# EAGLE board MOTOR_DRIVER_dupl (EAGLE 8.0.1)
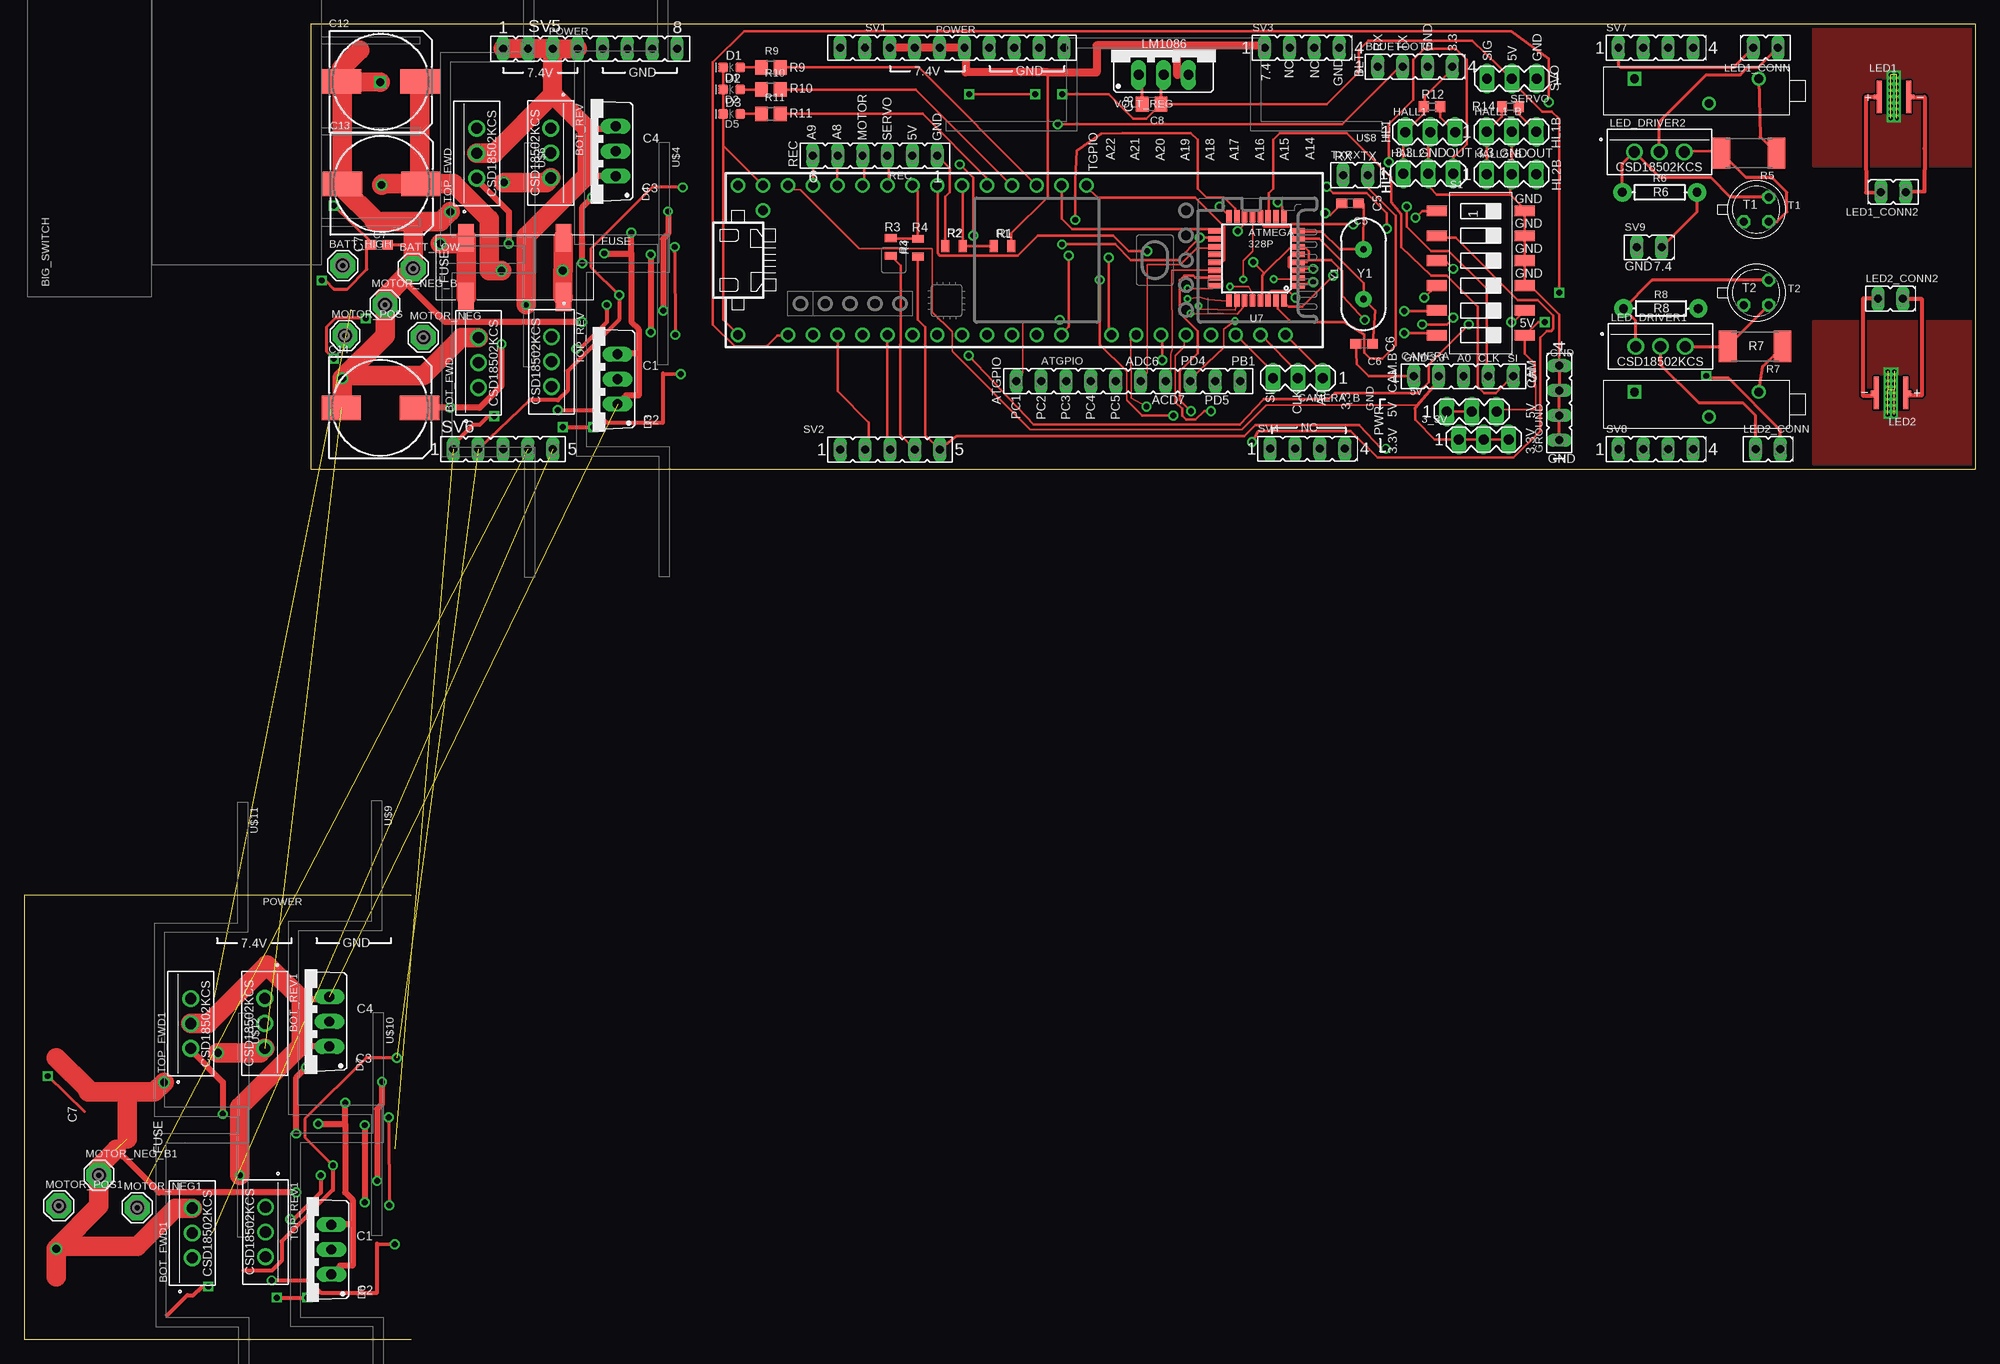
[diagram p5: board, top side]
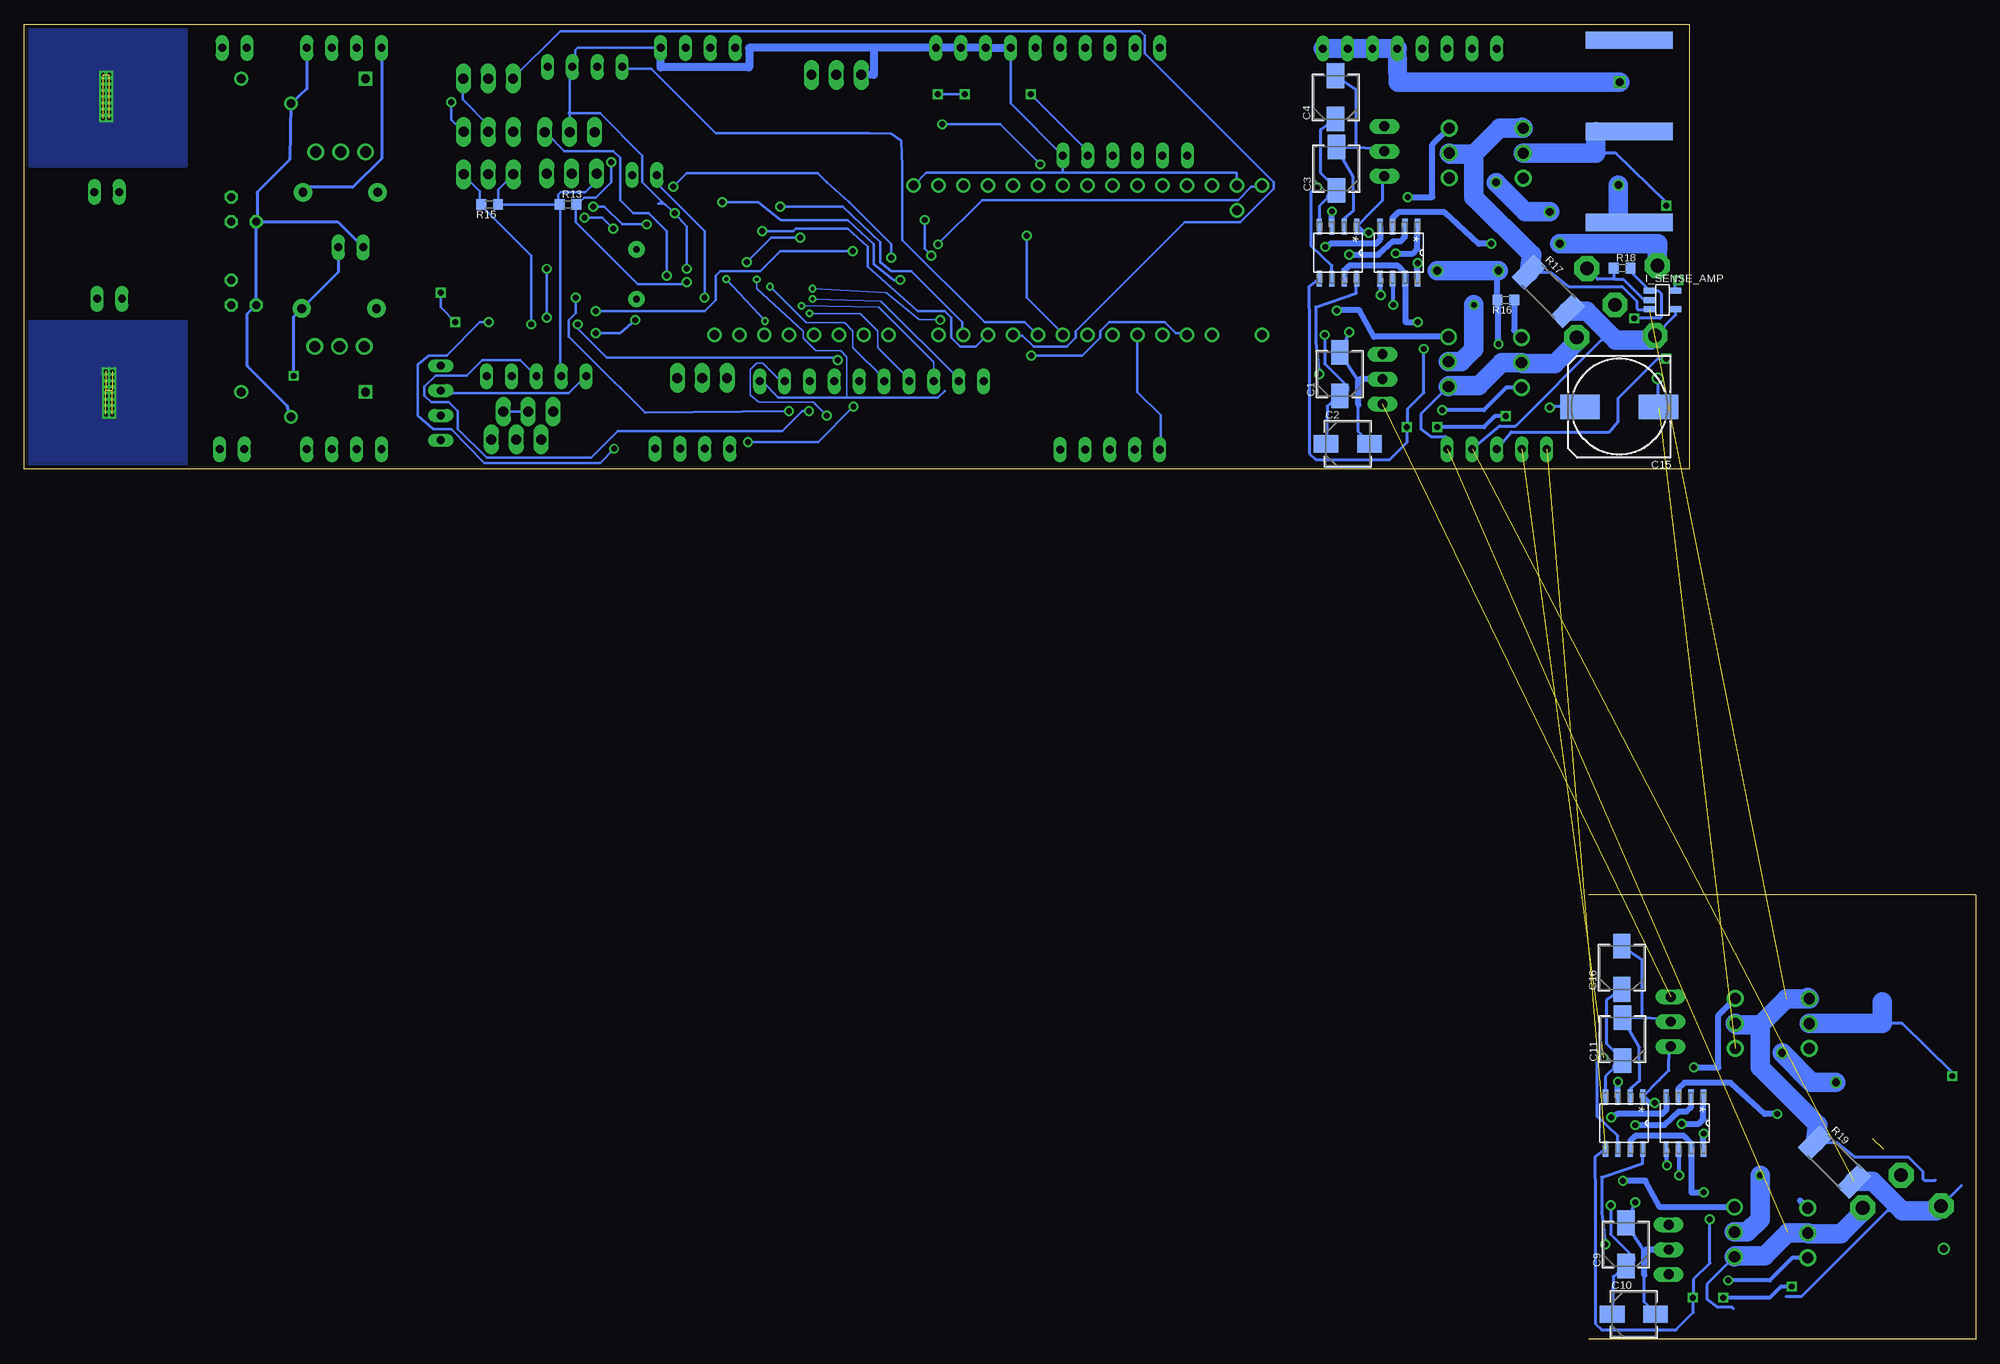
[diagram p6: board, bottom side, seen from below]

Size 199.21 x 134.29 mm. Coordinates in mm from the lower left corner, seen from the top.
Outline: 0,45.39 0,0
Outline: 0,45.39 39.5,45.39 39.5,45.39
Outline: 0,0 39.5,0
Outline: 29.21,88.9 199.21,88.9 199.21,134.29 29.21,134.29 29.21,88.9
Copper layers (1*16): Top 0.035559375mm / dielectric 1.501140625mm / Bottom 0.035559375mm
Design rules "typical_4pcb *": minimum track width 6mil, minimum drill 15mil, track to track 8mil, track to pad 8mil, pad to pad 8mil, via to via 8mil, smd to smd 6mil, copper to edge 15mil, drill to drill 8mil, minimum pad ring 10mil, minimum via ring 8mil, stop-mask expansion 4mil, vias tented up to drill 0mil, thermal gap 10mil
Net classes: 0 default: width 0.152 mm, drill 0.381 mm, clearance 0.152 mm

## Footprints (pad centres in the part's own frame; a part is rotated, then mirrored left to right if it is on the bottom)
MA03-1 = drill 1.016 long: 1 -2.54,0; 2 0,0; 3 2.54,0
FE10 = drill 0.813 long: 1 -11.43,0; 2 -8.89,0; 3 -6.35,0; 4 -3.81,0; 5 -1.27,0; 6 1.27,0; 7 3.81,0; 8 6.35,0; 9 8.89,0; 10 11.43,0
SE14 = drill 1.397 pad 2.54 octagon: MP 0,0
BIGSWITCH = smd 1.778 x 8.89 bottom: GND 4.65,0; NC 13.97,0; VCC -4.65,0
FE04-1 = drill 0.813 long: 1 -5.08,0; 2 -2.54,0; 3 0,0; 4 2.54,0
KCS3 = drill 1.143 pad 1.651: 1 -5.08,0; 2 -2.54,0; 3 0,0
CAP_EEE_B = smd 2.515 x 1.778: 1 -2.21,0; 2 2.21,0
C0603 = smd 1.1 x 1: 1 -0.85,0; 2 0.85,0
C0805 = smd 1.3 x 1.5: 1 -0.95,0; 2 0.95,0
153CLV-1010 = smd 4 x 2.5: + 4,0; - -4,0
FE05-1 = drill 0.813 long: 1 -5.08,0; 2 -2.54,0; 3 0,0; 4 2.54,0; 5 5.08,0
LED-0603 = smd 1 x 1: A -0.877,0; C 0.877,0
TO220ABS = drill 1.016 long: A1 -2.54,-2.54; A2 2.54,-2.54; C 0,-2.54
FUSEHOLDER3588 = smd 1.57 x 2.82: A -4.96,3.03; B 4.96,3.03; C -4.96,-3.03; D 4.96,-3.03
SOIC-8_M = smd 1.6 x 0.533: 1 -2.654,1.905; 2 -2.654,0.635; 3 -2.654,-0.635; 4 -2.654,-1.905; 5 2.654,-1.905; 6 2.654,-0.635; 7 2.654,0.635; 8 2.654,1.905
SOT23-5 = smd 0.6 x 1.2: 1 -0.95,-1.306; 2 0,-1.306; 3 0.95,-1.306; 4 0.95,1.306; 5 -0.95,1.306
XP = smd 0.5 x 3.3: NEGATIVE 1.5,0; POSITIVE -1.5,0 | smd 0.4 x 0.5: NEGATIVE1 1.85,0; POSITIVE1 -1.85,0 | smd 1.3 x 3.3: THERMAL 0,0
FE02-1 = drill 0.813 long: 1 -5.08,0; 2 -2.54,0
0805 = smd 0.8 x 1.2: 1 -0.9,0; 2 0.9,0
R2512 = smd 1.8 x 3.2: 1 -2.8,0; 2 2.8,0
AXIAL-0.3 = drill 0.9 pad 1.88: P$1 -3.81,0; P$2 3.81,0
R0805 = smd 1.3 x 1.5: 1 -0.95,0; 2 0.95,0
R0603 = smd 1 x 1.1: 1 -0.85,0; 2 0.85,0
FE06 = drill 0.813 long: 1 -6.35,0; 2 -3.81,0; 3 -1.27,0; 4 1.27,0; 5 3.81,0; 6 6.35,0
SMS-006 = smd 1.092 x 2.007: 1 -6.35,-4.496; 2 -3.81,-4.496; 3 -1.27,-4.496; 4 1.27,-4.496; 5 3.81,-4.496; 6 6.35,-4.496; 7 6.35,4.496; 8 3.81,4.496; 9 1.27,4.496; 10 -1.27,4.496; 11 -3.81,4.496; 12 -6.35,4.496
FE08 = drill 0.813 long: 1 -8.89,0; 2 -6.35,0; 3 -3.81,0; 4 -1.27,0; 5 1.27,0; 6 3.81,0; 7 6.35,0; 8 8.89,0
TO18 = drill 0.813 octagon: 1 -1.27,-1.27; 2 1.27,-1.27; 3 1.27,1.27
TQFP32-08 = smd 1.27 x 0.559: 1 -4.293,2.8; 2 -4.293,2; 3 -4.293,1.2; 4 -4.293,0.4; 5 -4.293,-0.4; 6 -4.293,-1.2; 7 -4.293,-2; 8 -4.293,-2.8; 17 4.293,-2.8; 18 4.293,-2; 19 4.293,-1.2; 20 4.293,-0.4; 21 4.293,0.4; 22 4.293,1.2; 23 4.293,2; 24 4.293,2.8 | smd 0.559 x 1.27: 9 -2.8,-4.293; 10 -2,-4.293; 11 -1.2,-4.293; 12 -0.4,-4.293; 13 0.4,-4.293; 14 1.2,-4.293; 15 2,-4.293; 16 2.8,-4.293; 25 2.8,4.293; 26 2,4.293; 27 1.2,4.293; 28 0.4,4.293; 29 -0.4,4.293; 30 -1.2,4.293; 31 -2,4.293; 32 -2.8,4.293
TEENSY_3.5/3.6_BASIC_FEWER_PIN = drill 0.965: 1/TX -22.86,-7.62; 2 -20.32,-7.62; 3/CANTX -17.78,-7.62; 3V3_LO -22.86,7.62; 4/CANRX -15.24,-7.62; 5 -12.7,-7.62; 6 -10.16,-7.62; 7 -7.62,-7.62; 8 -5.08,-7.62; 9/CS -2.54,-7.62; 10/CS 0,-7.62; 11/MOSI 2.54,-7.62; 12/MISO 5.08,-7.62; 13/SCK 5.08,7.62; 14/A0 2.54,7.62; 15/A1 0,7.62; 16/A2 -2.54,7.62; 17/A3 -5.08,7.62; 18/A4/SDA -7.62,7.62; 19/A5/SCL -10.16,7.62; 20/A6 -12.7,7.62; 21/A7 -15.24,7.62; 22/A8 -17.78,7.62; 23/A9 -20.32,7.62; 24 10.16,-7.62; 25 12.7,-7.62; 26 15.24,-7.62; 27 17.78,-7.62; 28 20.32,-7.62; 29 22.86,-7.62; 30 25.4,-7.62; 31/A12 27.94,-7.62; AGND -25.4,7.62; GND -27.94,-7.62; GND2 7.62,7.62; VIN -27.94,7.62; VUSB -25.4,5.08
POT = drill 0.9 square: P1 1.145,3.175 | drill 0.9: P2 3.685,10.795; P3 1.145,15.875
TO220S = drill 1.016 long: 1 -2.54,-2.54; 2 0,-2.54; 3 2.54,-2.54
HC49US = drill 0.7 pad 1.651: 1 -2.54,0; 2 2.54,0

## Placement (x,y rotation side)
3_3V  [MA03-1]  149,91.9 0 top
5V  [MA03-1]  147.78,94.75 0 top
ATGPIO  [FE10]  112.7,97.85 0 top
BATT_HIGH  SE14  [SE14]  32.48,109.66 0 top
BATT_LOW  SE14  [SE14]  39.68,109.36 0 top
BIG_SWITCH  [BIGSWITCH]  35.37,118.71 90 top
BLUETOOTH  [FE04-1]  143.26,129.97 0 top
BOT_FWD  CSD18502KCS_KCS_3  [KCS3]  46.35,102.29 90 top
BOT_FWD1  CSD18502KCS_KCS_3  [KCS3]  17.14,13.39 90 top
BOT_REV  CSD18502KCS_KCS_3  [KCS3]  53.75,118.62 270 top
BOT_REV1  CSD18502KCS_KCS_3  [KCS3]  24.54,29.72 270 top
C1  10uF  [CAP_EEE_B]  64.92,98.57 90 bottom
C2  10uF  [CAP_EEE_B]  64.1,91.45 0 bottom
C3  10uF  [CAP_EEE_B]  65.26,119.55 90 bottom
C4  10uF  [CAP_EEE_B]  65.33,126.84 90 bottom
C5  18 pF  [C0603]  135.36,116.01 180 top
C6  18 pF  [C0603]  136.79,101.67 180 top
C7  [C0603]  36.21,111.78 0 top
C8  10u  [C0805]  115.09,126.15 180 top
C9  10uF  [CAP_EEE_B]  35.71,9.67 90 bottom
C10  10uF  [CAP_EEE_B]  34.89,2.55 0 bottom
C11  10uF  [CAP_EEE_B]  36.05,30.65 90 bottom
C12  33u  [153CLV-1010]  36.38,128.45 0 top
C13  33u  [153CLV-1010]  36.47,118.01 0 top
C14  33u  [153CLV-1010]  36.33,95.15 0 top
C15  33u  [153CLV-1010]  36.38,95.25 180 bottom
C16  10uF  [CAP_EEE_B]  36.12,37.94 90 bottom
CAMERA  [FE05-1]  146.93,98.35 0 top
CAMERA_B  [MA03-1]  130.02,98.19 180 top
D1  [LED-0603]  72.21,129.9 180 top
D2  [LED-0603]  72.21,127.65 180 top
D3  BYV32  [TO220ABS]  58.01,98.06 90 top
D4  BYV32  [TO220ABS]  57.81,121.34 90 top
D5  [LED-0603]  72.21,125.15 180 top
D6  BYV32  [TO220ABS]  28.8,9.16 90 top
D7  BYV32  [TO220ABS]  28.6,32.44 90 top
FUSE  [FUSEHOLDER3588]  50.06,109.47 0 top
GATE1  MIC4604YM  [SOIC-8_M]  58.89,110.98 270 bottom
GATE2  MIC4604YM  [SOIC-8_M]  65.09,110.98 270 bottom
GATE3  MIC4604YM  [SOIC-8_M]  29.68,22.08 270 bottom
GATE4  MIC4604YM  [SOIC-8_M]  35.88,22.08 270 bottom
GROUND  [FE04-1]  156.71,96.9 90 top
HALL1  [MA03-1]  143.54,123.3 0 top
HALL1_B  [MA03-1]  151.84,123.32 0 top
HALL2  [MA03-1]  143.34,119.06 0 top
HALL2_B  [MA03-1]  151.84,118.98 0 top
I_SENSE_AMP  INA138  [SOT23-5]  31.96,106.15 270 bottom
LED1  CREE_XP  [XP]  190.88,126.88 0 top
LED1_CONN  [FE02-1]  173.96,131.9 180 top
LED1_CONN2  [FE02-1]  187.01,117.18 180 top
LED2  CREE_XP  [XP]  190.59,96.65 180 top
LED2_CONN  [FE02-1]  181.84,90.9 0 top
LED2_CONN2  [FE02-1]  194.34,106.28 0 top
LED_DRIVER1  CSD18502KCS_KCS_3  [KCS3]  169.59,101.4 0 top
LED_DRIVER2  CSD18502KCS_KCS_3  [KCS3]  169.46,121.28 0 top
MOTOR_NEG  SE14  [SE14]  40.72,102.33 0 top
MOTOR_NEG1  SE14  [SE14]  11.51,13.43 0 top
MOTOR_NEG_B  SE14  [SE14]  36.81,105.65 0 top
MOTOR_NEG_B1  SE14  [SE14]  7.6,16.75 0 top
MOTOR_POS  SE14  [SE14]  32.72,102.51 0 top
MOTOR_POS1  SE14  [SE14]  3.51,13.61 0 top
R1  2.8K  [0805]  99.87,111.64 0 top
R2  1.62K  [0805]  94.91,111.64 0 top
R3  2.32K  [0805]  88.45,111.55 270 top
R4  1.15K  [0805]  91.22,111.49 90 top
R5  1  [R2512]  176.09,121.15 180 top
R6  1k  [AXIAL-0.3]  166.96,117.15 0 top
R7  1  [R2512]  176.71,101.4 180 top
R8  1k  [AXIAL-0.3]  167.09,105.28 0 top
R9  59  [R0805]  76.21,129.9 0 top
R10  59  [R0805]  76.21,127.65 0 top
R11  59  [R0805]  76.21,125.15 0 top
R12  10k  [R0603]  143.71,125.9 0 top
R13  10k  [R0603]  143.71,115.9 0 bottom
R14  10k  [R0603]  151.71,125.9 0 top
R15  10k  [R0603]  151.71,115.9 180 bottom
R16  10k  [R0603]  47.96,106.15 180 bottom
R17  10m  [R2512]  43.61,107.01 315 bottom
R18  10k  [R0603]  36.09,109.4 0 bottom
R19  10m  [R2512]  14.4,18.11 315 bottom
REC  [FE06]  86.84,120.9 180 top
S1  SWS006  [SMS-006]  148.69,108.89 270 top
SERVO  [MA03-1]  151.87,128.75 180 top
SV1  [FE10]  94.71,131.9 0 top
SV2  [FE05-1]  88.38,90.87 0 top
SV3  [FE04-1]  131.71,131.9 0 top
SV4  [FE04-1]  132.27,90.95 0 top
SV5  [FE08]  57.76,131.83 0 top
SV6  [FE05-1]  48.87,90.91 0 top
SV7  [FE04-1]  167.84,131.9 0 top
SV8  [FE04-1]  167.84,90.9 0 top
SV9  [FE02-1]  169.71,111.53 0 top
T1  2N2222  [TO18]  176.84,115.4 0 top
T2  2N2222  [TO18]  176.84,106.9 0 top
TOP_FWD  CSD18502KCS_KCS_3  [KCS3]  46.18,123.68 90 top
TOP_FWD1  CSD18502KCS_KCS_3  [KCS3]  16.97,34.78 90 top
TOP_REV  CSD18502KCS_KCS_3  [KCS3]  53.82,97.31 270 top
TOP_REV1  CSD18502KCS_KCS_3  [KCS3]  24.61,8.41 270 top
TXRX  [FE02-1]  139.71,118.9 0 top
U7  ATMEGA328P_TQFP  [TQFP32-08]  125.79,110.38 180 top
U$1  TEENSY_3.5/3.6_FEWER  [TEENSY_3.5/3.6_BASIC_FEWER_PIN]  100.81,110.22 0 top
U$2  HEATSINK  [HEATSINK]  56.16,121.71 270 top
U$3  POT  [POT]  161.21,97.9 270 top
U$4  HEATSINK  [HEATSINK]  56.33,100.06 270 top
U$5  HEATSINK  [HEATSINK]  42.46,121.54 270 top
U$6  HEATSINK  [HEATSINK]  42.6,100.01 270 top
U$7  POT  [POT]  161.21,129.9 270 top
U$8  [HEATSINK]  116.34,132.9 180 top
U$9  HEATSINK  [HEATSINK]  26.95,32.81 270 top
U$10  HEATSINK  [HEATSINK]  27.12,11.16 270 top
U$11  HEATSINK  [HEATSINK]  13.25,32.64 270 top
U$12  HEATSINK  [HEATSINK]  13.39,11.11 270 top
VOLT_REG  LM1086TO220V  [TO220S]  116.31,131.69 0 top
Y1  16MHz  [HC49US]  136.71,108.78 90 top

## Tracks (layer width: path | path; a pad name or v marks a point on that pad's centre or on a via)
3_3V
  Top 0.152: U$1.3V3_LO 78.21,117.4 79.21,117.4 85.21,111.4 92.71,111.4 92.71,104.9 94.71,102.9 94.71,100.9 102.71,92.9 124.3,92.9 126.8,95.4 142.21,95.4 142.22,95.39
  Top 0.25: R14.1 150.86,124.89 HALL1_B.1 HALL2_B.1 | HALL2.1 140.8,123.1 HALL1.1 142.86,125.17 R12.1 142.96,126 142.96,126.9 145.8,129.74 BLUETOOTH.4
  Top 0.254: 3_3V.3 3_3V.2 3_3V.1 144.02,91.9 141.99,93.93 141.99,95.04 141.96,95.07
  Top 0.305: CAMERA.2 144.39,97.97 142.22,95.39 141.96,95.07
  Bottom 0.25: HALL2.1 140.8,118.31 141.96,117.15 144.46,117.15 144.71,116.9 144.71,116.05 R13.1 R15.1 150.86,117.42 HALL2_B.1
  Bottom 0.254: R13.1 144.53,115.69 144.53,98.43 CAMERA.2
5V  (via drill 0.6)
  Top 0.152: 5V.3 149.54,94.93 154.31,94.93 154.31,97.47 154.21,97.47
  Top 0.25: 154.21,97.32 154.21,97.47 154.21,99.65 153.19,100.67 S1.7 154.55,103.9 v155.21,103.9 | 5V.2 5V.1 | v96.46,127.15 v103.21,127.15 | v105.96,127.15 110.71,127.15 113.21,124.65 114.54,124.65 C8.1 132.96,126.15 136.21,129.4 136.21,131.65 137.21,132.65 147.84,132.65 SERVO.2 151.87,128.49 154.96,125.4 155.96,125.4 156.71,124.65 v156.71,106.9
  Top 0.305: C8.1 116.04,128.87 VOLT_REG.2
  Bottom 0.25: REC.2 90.65,121.34 v96.46,127.15 | 5V.3 5V.2 | v103.21,127.15 v105.96,127.15 | v156.71,106.9 156.71,105.4 v155.21,103.9
5V_TEENSY  (via drill 0.6)
  Top 0.254: 126.6,108.88 129.32,111.6 130,111.6 U7.6 130.23,111.6 130.68,111.6 131.14,111.15 131.14,110.24 | 126.6,108.88 126.37,108.65 126.37,106.15 U7.29 | 126.6,108.88 v125.46,110.01 | U7.18 121.38,112.51 v120.01,112.51 117.74,110.24 112.98,110.24 111.39,111.83 v105.94,111.83 | 131.14,110.24 130.91,110.01 130.23,110.01 U7.4 | v140.9,102.75 144.07,102.75 S1.6 | v136.83,104.11 134.54,106.61 134.54,109.1 133.41,110.24 131.14,110.24
  Bottom 0.254: v120.01,112.51 122.96,112.51 v125.46,110.01 | v140.9,102.75 138.4,102.75 v136.83,104.11 | v105.94,111.83 101.4,116.37 75.29,116.37 73.93,117.73 73.02,117.73 U$1.VIN
7_4V
  Top 0.25: R1.2 100.77,112.96 104.46,116.65 104.46,129.4
  Top 0.813: 117.71,132.15 109.46,132.15 109.46,129.4 104.46,129.4 96.09,129.4 96.09,131.8 SV1.6 SV1.5 SV1.4 SV1.3 | 117.71,132.15 126.63,132.15 SV3.1 | VOLT_REG.3 117.71,129.15 117.71,132.15
7_4V_TOP  (via drill 0.6)  (1 unrouted)
  Top 0.305: v30.34,108.15 30.71,108.15 31.59,107.28 32.96,107.28 34.96,109.28 34.96,111.38 C7.1 35.36,112.12 v31.59,115.78 | 6.15,23.23 v2.38,26.88
  Top 0.61: 61.96,110.9 v61.96,113.04 | 61.96,110.9 61.96,103.9 62.71,103.15 62.71,100.65 | 57.46,123.65 60.12,123.65 D4.A2 | D4.A1 57.56,118.8 57.46,118.9 | 62.71,100.65 60.6,100.65 D3.A2 | D3.A1 61.43,96.4 62.71,96.4 62.71,100.65 | v59.21,110.9 61.96,110.9 | 32.75,22 v32.75,24.14 | 32.75,22 32.75,15 33.5,14.25 33.5,11.75 | 28.25,34.75 30.91,34.75 D7.A2 | D7.A1 28.35,29.9 28.25,30 | 33.5,11.75 31.39,11.75 D6.A2 | D6.A1 32.22,7.5 33.5,7.5 33.5,11.75 | v30,22 32.75,22
  Top 1.93: 53.96,127.15 SV5.3 | SV5.3 SV5.4 | SV5.3 SV5.2 SV5.1
  Top 2: TOP_FWD.2 47.95,121.14 53.96,127.15 57.46,123.65 57.46,118.9 51.21,112.65 v51.21,105.65 | TOP_FWD1.2 18.74,32.24 24.75,38.25 28.25,34.75 28.25,30 22,23.75 v22,16.75
  Bottom 0.305: GATE2.1 61.49,115.38 60.51,116.35 60.5,118.65 | I_SENSE_AMP.5 30.65,107.83 v30.34,108.15 | v31.59,115.78 31.59,116.15 36.71,121.15 38.74,121.15 38.75,121.14 | GATE4.1 32.28,26.48 31.3,27.45 31.29,29.75 | v2.38,26.88 2.38,27.25 7.5,32.25 9.53,32.25 9.54,32.24
  Bottom 0.61: 60.5,118.65 D4.A1 | 56.96,113.66 GATE1.1 56.99,111.38 57.46,110.9 v59.21,110.9 | v61.96,113.04 62.59,113.04 GATE2.1 | 31.29,29.75 D7.A1 | 27.75,24.76 GATE3.1 27.78,22.48 28.25,22 v30,22 | v32.75,24.14 33.38,24.14 GATE4.1
  Bottom 1.27: BIG_SWITCH.GND 38.75,123.36 38.96,123.15 | 9.54,34.46 9.75,34.25
  Bottom 2: TOP_FWD.2 38.75,121.14 38.75,123.36 | TOP_REV.2 52.51,99.85 51.21,101.15 v51.21,105.65 | TOP_FWD1.2 9.54,32.24 9.54,34.46 | TOP_REV1.2 23.3,10.95 22,12.25 v22,16.75
7_4V_TOP2  (via drill 0.6)
  Top 0.305: SV7.1 162.76,130.11 162.96,129.9 174.5,129.9 LED1_CONN.2 | R6.P$2 170.77,115.12 SV9.2 | LED2_CONN.2 179.3,92.87 174.01,98.15 171.96,98.15 v171.71,98.4
  Bottom 0.305: SV7.1 162.76,120.61 165.71,117.65 170.27,117.65 R6.P$2 | SV9.2 167.17,109 R8.P$2 171.71,104.46 v171.71,98.4
ADC6
  Top 0.152: U7.19 121.29,111.44 119.7,111.44 118,109.74 114.62,109.74 114.62,98.74 113.98,98.11 ATGPIO.6
  Top 0.254: 121.38,111.6 U7.19
ADC7
  Top 0.152: U7.22 121.29,109.22 117.16,109.22 117.2,101.09 117.04,100.62 117.04,98.31 116.58,97.85 ATGPIO.7
  Top 0.254: 121.38,109.1 U7.22
BATT_VOLTAGE  (via drill 0.8)
  Top 0.813: 45.1,111.9 44.21,111.9
  Top 2: FUSE.A 45.1,111.9 FUSE.C | 44.21,111.9 v42.46,111.9
  Bottom 2: BATT_HIGH.MP 32.48,111.4 32.46,111.4 32.46,111.9 v42.46,111.9
BATT_VOLTAGE_SENSE
  Top 0.25: U$1.17/A3 95.81,117.76 R2.2 R1.1
BLT_RX
  Bottom 0.254: BLUETOOTH.1 138.17,129.76 135.22,129.76 128.64,123.18 112.98,123.18 110.71,123.15 109.71,122.4 109.57,119.77 109.57,112.28 101.17,103.88 97.09,103.88 95.95,102.75 U$1.8
BLT_TX  (via drill 0.6)
  Top 0.254: v105.48,124.09 134.54,124.09 140.22,129.76 140.67,129.76 BLUETOOTH.2 | v95.5,120 96.86,118.64 v96.86,112.74
  Bottom 0.254: v105.48,124.09 99.58,124.09 v95.5,120 | v96.86,112.74 96.86,106.38 93.23,102.75 U$1.7
CAMERA_A0  (via drill 0.6)
  Top 0.254: v119.11,94.8 117.97,95.94 117.97,98.89 119.79,100.7 119.79,102.97 117.97,104.79 117.97,108.2 118.42,108.65 119.33,108.65 119.56,108.42 121.38,108.42 U7.23
  Bottom 0.254: v119.11,94.8 119.79,94.8 121.83,92.76 138.63,92.76 141.35,90.04 152.02,90.04 154.97,92.99 154.97,94.8 155.88,95.71 157.69,95.71 158.38,96.39 158.38,97.3 157.24,98.43 154.06,98.43 152.47,100.02 148.62,100.02 147.03,98.43 CAMERA.3
CAMERA_A0_B
  Top 0.152: CAMERA_B.1 132.72,98.43 132.72,98.74 132.66,98.69
  Top 0.25: 132.76,98.59 132.66,98.69 U$1.31/A12
CAMERA_CL  (via drill 0.6)
  Top 0.254: v135.68,113.87 129.32,113.87 129.09,113.64 126.6,113.64 126.37,113.87 126.37,114.55 U7.12 | v141.12,115.69 141.12,113.64 143.62,111.15 145.44,111.15 149.3,107.29 149.3,98.43 CAMERA.4
  Bottom 0.254: v135.68,113.87 138.17,113.87 139.99,115.69 v141.12,115.69
CAMERA_CL_B
  Top 0.152: CAMERA_B.2 130.18,98.43 130.18,98.74 130.12,98.69
  Top 0.25: 130.22,98.59 130.12,98.69 U$1.30
CAMERA_SI
  Top 0.254: U7.11 127.05,114.78 127.05,117.05 127.5,117.5 127.5,122.5 128.19,123.18 135,123.18 139.53,118.64 139.53,116.12 140.56,114.92 140.56,111.54 143.62,108.65 145.21,108.65 148.39,105.47 148.39,97.3 149.07,96.62 150.2,96.62 151.79,98.21 CAMERA.5
CAMERA_SI_B
  Top 0.152: CAMERA_B.3 127.64,98.43 127.64,98.74 127.58,98.69
  Top 0.25: 127.68,98.59 127.58,98.69 U$1.29
EMF_SENSE_HIGH
  Top 0.25: R3.1 88.52,112.39 R4.2 91.22,117.27 U$1.19/A5/SCL
EMF_SENSE_LOW  (via drill 0.6)
  Top 0.254: v140.9,105.02 144.07,105.02 S1.5 | v114.65,111.15 112.75,111.15 111.16,112.74 103.44,112.74 101.4,110.69 93.45,110.69 93.23,110.92 93.23,117.73 U$1.18/A4/SDA
  Bottom 0.254: v140.9,105.02 129.77,105.02 128.64,106.15 128.64,108.65 128.19,109.1 124.1,109.1 122.06,111.15 v114.65,111.15
GND  (via drill 0.6)
  Top 0.25: D1.C D2.C D5.C 71.33,121.92 | 71.33,121.92 U$1.AGND | 71.33,121.92 71.33,104.14 U$1.GND | R2.1 94.01,116.7 94.46,117.15 94.46,119.62 REC.1 | 137.91,98.35 CAMERA.1 | C6.2 136.01,99.66 | 156.71,104.65 153.74,107.62 S1.9 S1.10 S1.11 S1.12 153.19,115.42 151.71,116.9 | 151.71,116.9 144.21,116.9 143.46,117.65 143.46,118.94 HALL2.2 143.34,123.1 HALL1.2 | 151.71,116.9 151.71,118.86 HALL2_B.2 HALL1_B.2
  Top 0.254: U7.5 130,110.69 129.32,110.69 129.09,110.47 129.09,109.56 129.32,109.33 130,109.33 U7.3 130.23,109.33 v131.59,109.33 | U7.21 121.6,110.01 122.28,110.01 122.51,110.24 122.51,113.64 119.56,116.59 109.57,116.59 108.44,117.73 U$1.GND2 | 136.01,99.66 136.01,99.6 137.26,98.35 137.9,98.35 137.91,98.35 | 156.71,104.65 GROUND.4 | C5.2 134.51,115.96 133.35,114.81 v132.8,115.02
  Top 0.305: GROUND.1 GROUND.2 GROUND.3 GROUND.4 | C8.2 114.14,128.78 VOLT_REG.1
  Bottom 0.25: U$1.AGND 75.41,119.1 75.46,119.15 93.21,119.15 | 93.21,119.15 93.21,120.88 REC.1 98.52,126.24 SV1.7 | 93.21,119.15 107.12,119.15 U$1.GND2 | HALL1_B.2 151.84,124.03 154.46,126.65 154.46,128.57 SERVO.1 | HALL1.2 143.54,125.22 143.54,129.69 BLUETOOTH.3 142.96,130.27 142.96,131.65 142.71,131.9 SV3.4
  Bottom 0.254: v131.59,109.33 131.59,113.64 v132.8,115.02 133.86,115.91 C5.2 134.09,116.14 136.13,118.18 136.13,120.91 140.44,125.22 143.54,125.22 143.62,125.22 | CAMERA.1 142.03,98.21 143.62,96.62 156.33,96.62 156.56,96.84 GROUND.3
  Bottom 0.81: SV1.7 SV1.8 SV1.9 SV1.10
  Bottom 0.813: SV1.10 112.46,131.9 | 112.46,131.9 125.21,131.9 125.21,129.9 134.25,129.9 SV3.4 | VOLT_REG.1 112.46,129.15 112.46,131.9
GND_TOP  (via drill 0.6, 0.8, 0.8 pad 0.61)  (2 unrouted)
  Top 0.305: C7.2 39.46,111.78 39.71,111.53 | 10.25,22.88 10.5,22.62
  Top 0.4: 38.59,108.27 39.34,107.52 38.68,107.52 MOTOR_NEG_B.MP | 9.38,19.37 10.13,18.62 9.47,18.62 MOTOR_NEG_B1.MP
  Top 0.61: 39.34,107.52 42.96,103.9 v56.96,103.9 | 10.13,18.62 13.75,15 v27.75,15
  Top 2: C12.- 32.47,128.36 C13.- 32.47,117.64 35.71,114.4 35.71,114.15 39.71,114.15 | C12.- 32.38,129.82 34.21,131.65 | 32.71,98.4 36.81,102.5 MOTOR_NEG_B.MP 36.81,106.49 38.59,108.27 BATT_LOW.MP 39.71,109.36 39.71,111.53 39.71,114.15 | C14.- 32.46,95.28 v32.46,98.15 32.71,98.4 | BOT_FWD.3 44.6,102.29 40.71,98.4 32.71,98.4 | 39.71,114.15 42.46,114.15 v43.46,115.15 | v48.96,118.15 53.28,118.15 BOT_REV.3 | C12.- v36.34,128.4 | 3.5,9.5 7.6,13.6 MOTOR_NEG_B1.MP 7.6,17.59 9.38,19.37 | 3.25,6.38 v3.25,9.25 3.5,9.5 | 3.26,28.74 6.5,25.5 6.5,25.25 10.5,25.25 | 10.5,25.25 10.5,22.62 10.5,20.46 | BOT_FWD1.3 15.39,13.39 11.5,9.5 3.5,9.5 | 10.5,25.25 13.25,25.25 v14.25,26.25 | v19.75,29.25 24.07,29.25 BOT_REV1.3
  Bottom 0.305: C15.- 32.38,98.07 v32.46,98.15 | I_SENSE_AMP.2 33.84,106.15 35.96,108.28 36.84,108.28 | 36.84,108.28 38.6,108.28 BATT_LOW.MP | R18.1 36.94,108.38 36.84,108.28 | 3.17,9.17 v3.25,9.25
  Bottom 0.61: 58.21,108.28 58.21,103.9 v56.96,103.9 | 58.21,108.28 GATE1.7 | GATE2.7 64.46,109.15 63.96,109.65 58.96,109.65 58.21,108.9 58.21,108.28 | R16.1 47.11,103.05 BOT_FWD.3 | 29,19.38 29,15 v27.75,15 | 29,19.38 GATE3.7 | GATE4.7 35.25,20.25 34.75,20.75 29.75,20.75 29,20 29,19.38 | 17.9,14.15 BOT_FWD1.3
  Bottom 1.93: 58.96,128.4 SV5.5 SV5.6 SV5.7 SV5.8
  Bottom 2: v43.46,115.15 45.96,115.15 v48.96,118.15 | v36.34,128.4 58.96,128.4 | v14.25,26.25 16.75,26.25 v19.75,29.25
GND_TOP2
  Bottom 0.305: U$3.P2 172.38,95.32 176.46,99.4 176.46,104.74 T2.1 T1.1 | SV7.4 170.38,127.72 U$7.P2 172.13,120.48 175.46,117.15 175.46,114.24 T1.1 | T1.1 167.24,114.13 SV9.1
HALL1  (via drill 0.6)
  Top 0.25: R12.2 144.56,124.82 HALL1.3
  Top 0.254: v133.63,108.65 130.45,105.47 129.09,105.47 128.64,105.93 U7.32
  Bottom 0.254: v133.63,108.65 133.63,113.19 135.45,115.01 137.04,115.01 138.4,116.37 138.4,120.68 139.08,121.36 144.07,121.36 145.89,123.18 HALL1.3
HALL1_B  (via drill 0.6)
  Top 0.25: R14.2 152.56,125.14 HALL1_B.3
  Top 0.254: v155.65,126.36 155.65,130.78 151.79,133.62 73.48,133.62 70.3,130.44 70.3,103.66 72.57,101.39 75.75,101.39 76.88,102.52 77.79,102.52 U$1.1/TX
  Bottom 0.254: v155.65,126.36 155.65,124.54 154.52,123.4 HALL1_B.3
HALL2  (via drill 0.6)
  Top 0.254: v131.59,107.97 131.14,107.97 130.91,107.74 130.23,107.74 U7.1 | v139.31,120.23 139.31,124.09 141.81,126.58 141.81,130.67 142.94,131.8 146.12,131.8 147.25,130.67 147.25,122.04 145.89,120.68 145.89,119.09 HALL2.3
  Bottom 0.254: v131.59,107.97 131.82,107.74 136.58,107.74 142.94,114.1 142.94,115.69 R13.2 142.71,115.91 142.03,116.59 140.9,116.59 139.31,118.18 v139.31,120.23
HALL2_B  (via drill 0.6)
  Top 0.254: v147.48,103.66 143.39,99.57 143.39,97.75 142.26,96.62 133.79,96.62 133.17,96 132.42,96.01 126.52,96.01 124.1,93.44 103.06,93.44 v96.43,100.48
  Bottom 0.254: HALL2_B.3 154.29,118.86 152.7,117.28 152.7,115.91 R15.2 152.47,115.69 147.48,110.69 v147.48,103.66 | v96.43,100.48 91.18,100.48 89.37,102.29 89.37,102.97 88.46,103.88 82.78,103.88 81.65,102.75 80.52,102.75 U$1.2
HI
  Top 0.25: U$1.3/CANTX 83.03,96.83 86.21,93.65 86.21,91.29 SV2.2
HI_TOP  (via drill 0.6, 0.6 pad 0.61)  (1 unrouted)
  Top 0.305: v67.21,117.65 64.09,117.65 57.84,111.4 57.84,109.53 v60.71,106.65 | 51.57,95.9 SV6.2 | v38,28.75 34.88,28.75 28.63,22.5 28.63,20.62 v31.5,17.75
  Top 0.4: v60.71,106.65 60.71,104.15 55.46,98.9 55.46,96.9 54.46,95.9 51.57,95.9 | v31.5,17.75 31.5,15.25 26.25,10 26.25,8 25.25,7 22.36,7
  Bottom 0.305: GATE2.6 65.73,109.67 67.84,111.65 67.84,117.15 v67.21,117.65 | GATE4.6 36.52,20.77 38.63,22.75 38.63,28.25 v38,28.75
  Bottom 0.4: GATE1.5 60.8,106.74 v60.71,106.65 | GATE3.5 31.59,17.84 v31.5,17.75
I_SENSE
  Top 0.254: SV2.3 88.12,91.15 U$1.5
I_SENSE_HI_TOP  (2 unrouted)
  Bottom 0.305: R17.1 43.43,108.99 41.59,107.53 36.09,107.53 34.59,106.03 34.59,105.28 34.46,105.15 33.32,105.15 I_SENSE_AMP.3 | R19.1 14.22,20.09 12.38,18.62 6.88,18.62 5.38,17.12 5.38,16.38 5.25,16.25 4.11,16.25
  Bottom 2: R17.1 45.33,110.77 51.21,116.65 51.21,121.03 | 51.21,121.03 53.61,121.03 BOT_REV.2 | 46.32,123.82 TOP_FWD.3 48.56,123.68 51.21,121.03 | R19.1 16.12,21.87 22,27.75 22,32.13 | 22,32.13 24.4,32.13 BOT_REV1.2 | 17.11,34.92 TOP_FWD1.3 19.35,34.78 22,32.13
I_SENSE_LOW_TOP  (2 unrouted)
  Bottom 0.305: I_SENSE_AMP.4 30.65,104.58 MOTOR_POS.MP | 36.71,102.03 38.21,102.03 46.96,93.28 48.59,93.28 SV6.4 | 1.45,15.68 MOTOR_POS1.MP | 7.5,13.12 9,13.12 17.75,4.38 19.38,4.38
  Bottom 2: R17.2 39.72,105.03 36.71,102.03 33.21,102.03 MOTOR_POS.MP 32.86,102.65 | R19.2 10.51,16.13 7.5,13.12 4,13.12 MOTOR_POS1.MP 3.65,13.75
I_SENSE_TOP  (via drill 0.6)
  Top 0.305: v34.84,104.28 31.71,104.28 30.84,103.4 30.84,100.9 v31.59,100.15
  Bottom 0.305: R18.2 35.24,109.07 I_SENSE_AMP.1 32.41,107.1 32.09,106.78 32.09,104.4 32.21,104.28 v34.84,104.28 | v31.59,100.15 32.46,100.15 36.46,96.15 36.46,93.78 37.41,92.68 47.41,92.68 SV6.3
LED1
  Top 0.25: R9.2 91.29,129.9 U$1.14/A0
LED1HI
  Top 0.152: LED1.POSITIVE1 189.23,127 LED1.POSITIVE
  Top 0.406: LED1.POSITIVE LED1.POSITIVE1 188.01,126.88 188.01,121.63 188.05,117.13 LED1_CONN2.2
LED1LO
  Top 0.152: LED1.NEGATIVE1 192.72,127 LED1.NEGATIVE1
  Top 0.406: LED1.NEGATIVE LED1.NEGATIVE1 194.01,126.88 194.01,121.63 193.99,117.23 LED1_CONN2.1
LED2
  Top 0.25: R10.2 91,127.65 U$1.15/A1
LED2HI
  Top 0.152: LED2.POSITIVE 192.09,96.84 192.41,96.84 LED2.POSITIVE1
  Top 0.406: LED2_CONN2.2 193.71,106.28 193.71,96.4 192.44,96.4 LED2.POSITIVE1
LED2LO
  Top 0.152: LED2.NEGATIVE 188.91,96.84 LED2.NEGATIVE1
  Top 0.406: LED2_CONN2.1 187.71,106.28 187.71,96.4 188.74,96.4 LED2.NEGATIVE1
LED3
  Top 0.25: U$1.16/A2 98.21,117.9 98.21,118.65 91.71,125.15 R11.2
LI
  Bottom 0.25: U$1.4/CANRX 85.57,96.76 83.21,94.4 83.21,90.97 SV2.1
LI_TOP  (via drill 0.6, 0.6 pad 0.61)  (1 unrouted)
  Top 0.152: SV6.1 43.82,91.12 43.82,91.44 43.85,91.41 | 14.61,2.22 14.61,2.54 14.64,2.51
  Top 0.4: v59.46,105.65 59.46,103.9 56.71,101.15 v56.34,101.15 | v30.25,16.75 30.25,15 27.5,12.25 v27.13,12.25
  Top 0.406: 43.78,91.34 43.85,91.41 45.84,93.4 46.46,93.4 47.34,94.28 v47.96,94.28 | v54.96,93.15 v58.09,93.15 | 14.57,2.45 14.64,2.51 16.63,4.5 17.25,4.5 18.13,5.38 v18.75,5.38 | v25.75,4.25 v28.88,4.25
  Bottom 0.305: GATE2.5 68.06,107.52 68.02,103 68.02,90.48 67.39,89.85 59.81,89.85 58.02,91.64 58.02,93.08 v58.09,93.15 58.02,93.22 58.02,95 56.34,96.67 | 56.34,96.65 56.34,96.67 | 56.34,96.67 v56.34,101.15 | GATE4.5 38.85,18.62 38.81,14.1 38.81,1.58 38.18,0.95 30.6,0.95 28.8,2.74 28.8,4.18 v28.88,4.25 28.8,4.32 28.8,6.1 27.13,7.77 | 27.13,7.75 27.13,7.77 | 27.13,7.77 v27.13,12.25
  Bottom 0.4: GATE1.6 59.53,105.72 v59.46,105.65 | GATE3.6 30.32,16.82 v30.25,16.75
  Bottom 0.406: v47.96,94.28 49.09,94.28 50.21,93.15 v54.96,93.15 | v18.75,5.38 19.88,5.38 21,4.25 v25.75,4.25
MOTOR_HIGH
  Top 0.25: 89.46,101.65 89.46,109.64 R3.2
  Top 0.254: 89.46,101.65 89.41,101.65 89.41,92.38 SV2.4
MOTOR_LOW  (via drill 0.6)
  Top 0.25: R4.1 91.22,104.14 91.96,103.4 91.96,98.4
  Top 0.254: v151.79,103.88 152.02,103.88 153.16,105.02 S1.8 | v139.01,90.95 138.53,90.95 136.27,93.37 125.69,93.37 124.55,92.23 95.12,92.23 SV2.5 91.96,92.37 91.96,98.4
  Bottom 0.254: v151.79,103.88 152.7,103.88 156.11,100.48 157.92,100.48 159.03,99.57 159.03,94.35 157.47,92.99 155.65,92.99 152.29,89.48 140.42,89.48 v139.01,90.95
MOTOR_LOW_TOP  (1 unrouted)
  Bottom 0.305: TOP_REV.3 56.64,94.49 56.64,92.96 55.63,92.2 54.1,92.2 53.94,92.04 53.95,92.04 SV6.5 | TOP_REV1.3 27.43,5.59 27.43,4.06 26.42,3.3 24.89,3.3 24.73,3.14 24.74,3.14
  Bottom 2: MOTOR_NEG.MP 40.72,101.89 42.96,99.65 46.25,99.65 BOT_FWD.2 48.36,99.75 50.71,97.4 53.73,97.4 TOP_REV.3 | MOTOR_NEG1.MP 11.51,12.99 13.75,10.75 17.04,10.75 BOT_FWD1.2 19.15,10.85 21.5,8.5 24.52,8.5 TOP_REV1.3
N$1
  Top 0.305: U$7.P3 177.21,122.83 R5.1
N$2  (via drill 0.6)
  Top 0.61: v57.96,116.65 56.96,115.65 v56.96,109.9
  Bottom 0.61: GATE1.8 56.99,109.62 v56.96,109.9 | v57.96,116.65 55.46,116.65 55.46,121.99 BOT_REV.1
N$3  (via drill 0.6)
  Top 0.61: TOP_FWD.1 46.18,118.43 49.46,115.15 v49.46,111.9
  Bottom 0.305: 59.54,113.65 GATE1.3
  Bottom 0.61: v49.46,111.9 50.71,111.9 54.21,115.09 58.95,115.09 59.54,114.5 59.54,113.65
N$4  (via drill 0.6)
  Top 0.305: v66.41,111.57 66.41,111.39 66.38,111.02 v66.46,102.59
  Bottom 0.305: C2.1 66.21,95.29 C1.1 64.11,96.87 64.11,97.28 66.46,99.63 v66.46,102.59
  Bottom 0.61: GATE1.4 60.8,112.31 61.21,111.9 65.79,111.91 65.8,111.9 v66.41,111.57
N$5  (via drill 0.6)
  Top 0.61: v63.96,110.78 v63.96,102.87
  Bottom 0.305: 63.04,97.9 C1.2 v63.96,102.87 | C2.2 61.89,91.55 63.04,92.71 63.04,95.41 63.01,95.44
  Bottom 0.61: 63.01,95.44 63.04,97.9 62.88,98.06 D3.C | GATE1.2 58.26,112.61 58.71,112.15 59.46,112.15 60.96,110.78 v63.96,110.78
N$6
  Top 0.25: C6.1 137.91,105.08 Y1.1 136.73,107.89 132.21,112.4 130.1,112.4 U7.7
N$7
  Top 0.25: C5.1 136.73,115.91 Y1.2 134.27,111.34 132.46,113.15 130.11,113.15 U7.8
N$8
  Top 0.254: LED_DRIVER2.3 169.5,121.36 173.13,121.36 R5.2
  Top 0.305: T1.2 178.94,114.13 179.96,115.15 179.96,117.15 178.46,118.65 175.79,118.65 R5.2
N$9  (via drill 0.6)
  Top 0.4: v54.46,94.9 58.21,94.9 59.46,93.65 65.21,93.65 65.21,98.65 v67.01,98.59
  Bottom 0.305: 63.21,108.3 63.21,106.86 67.38,105.44 67.38,101.82 v67.01,98.59
  Bottom 0.4: BOT_FWD.1 47.9,97.21 50.21,94.9 v54.46,94.9 | 63.21,108.3 GATE2.8
N$10  (via drill 0.6)
  Top 0.61: v65.71,115.2 65.71,112.9 65.21,112.4 v65.21,105.06
  Bottom 0.305: 65.18,105.09 v65.21,105.06
  Bottom 0.61: GATE2.3 65.73,115.39 v65.71,115.2 | TOP_REV.1 61.44,102.39 62.92,105.09 65.18,105.09
N$11
  Bottom 0.305: 65.79,118.01 66.85,119.08 66.85,123.57 C4.1 | 66,116.73 67.01,115.72 67.01,113.64
  Bottom 0.61: 65.79,118.01 65.79,116.73 C3.1 66,116.73 | 67.01,113.64 GATE2.4
N$12
  Bottom 0.305: 63.25,121.76 C3.2 63.54,118.75 63.5,115.27 64.46,114.46 GATE2.2 | 63.25,121.76 63.25,127.62 C4.2 | 63.25,121.76 60.54,121.61
  Bottom 0.61: 60.54,121.61 D4.C
N$13
  Top 0.305: U$3.P3 177.46,99.35 R7.1
N$16
  Top 0.305: R6.P$1 163.15,120.05 LED_DRIVER2.1 167.01,118.65 172.21,118.65 174.19,116.67 T1.3
N$17
  Top 0.305: LED_DRIVER2.2 166.92,124.36 171.71,129.15 175.21,129.15 175.96,129.9 177.04,129.9 LED1_CONN.1
N$18
  Top 0.305: T2.2 173.91,101.44 R7.2 LED_DRIVER1.3
N$19
  Top 0.305: T2.3 166.17,108.17 R8.P$1 164.51,104.05 LED_DRIVER1.1
N$20
  Top 0.305: LED_DRIVER1.2 167.05,99.56 170.96,95.65 175.46,95.65 176.71,94.4 176.71,90.95 LED2_CONN.1
N$21  (via drill 0.6, 0.6 pad 0.61, 0.8)
  Top 0.61: C14.+ v43.46,95.15 46.46,95.15 48.71,97.4 v48.71,101.65
  Top 2: C12.+ 40.38,118.1 C13.+ | C13.+ 36.57,118.01 v36.46,117.9 | C13.+ 43.85,118.01 47.46,114.4 47.46,109.15 v48.71,109.15 | FUSE.D 54.96,106.49 v54.96,109.15 55.02,109.21 FUSE.B
  Bottom 0.305: C15.+ 43.36,95.25 v43.46,95.15
  Bottom 0.61: v48.71,101.65 48.71,106.05 R16.2 48.81,109.05 v48.71,109.15
  Bottom 1.016: BIG_SWITCH.VCC 36.46,115.15
  Bottom 2: 36.46,115.15 v36.46,117.9 | v48.71,109.15 v54.96,109.15
N$22
  Top 0.25: R9.1 D1.A
N$23
  Top 0.25: D2.A R10.1
N$24
  Top 0.25: R11.1 D5.A
N$25  (via drill 0.6)
  Top 0.61: v28.75,27.75 27.75,26.75 v27.75,21
  Bottom 0.61: GATE3.8 27.78,20.73 v27.75,21 | v28.75,27.75 26.25,27.75 26.25,33.09 BOT_REV1.1
N$26  (via drill 0.6)
  Top 0.61: TOP_FWD1.1 16.97,29.53 20.25,26.25 v20.25,23
  Bottom 0.305: 30.33,24.75 GATE3.3
  Bottom 0.61: v20.25,23 21.5,23 25,26.2 29.74,26.2 30.33,25.6 30.33,24.75
N$27  (via drill 0.6)
  Top 0.305: v37.2,22.67 37.2,22.49 37.17,22.12 v37.25,13.69
  Bottom 0.305: C10.1 37,6.39 C9.1 34.9,7.97 34.9,8.38 37.25,10.73 v37.25,13.69
  Bottom 0.61: GATE3.4 31.59,23.42 32,23 36.58,23.01 36.59,23 v37.2,22.67
N$28  (via drill 0.6)
  Top 0.61: v34.75,21.88 v34.75,13.97
  Bottom 0.305: 33.83,9 C9.2 v34.75,13.97 | C10.2 32.68,2.65 33.83,3.81 33.83,6.51 33.8,6.54
  Bottom 0.61: 33.8,6.54 33.83,9 33.67,9.16 D6.C | GATE3.2 29.05,23.71 29.5,23.25 30.25,23.25 31.75,21.88 v34.75,21.88
N$29  (via drill 0.6)
  Top 0.4: v25.25,6 29,6 30.25,4.75 36,4.75 36,9.75 v37.8,9.7
  Bottom 0.305: 34,19.4 34,17.96 38.16,16.54 38.16,12.92 v37.8,9.7
  Bottom 0.4: BOT_FWD1.1 18.69,8.31 21,6 v25.25,6 | 34,19.4 GATE4.8
N$30  (via drill 0.6)
  Top 0.61: v36.5,26.3 36.5,24 36,23.5 v36,16.16
  Bottom 0.305: 35.97,16.19 v36,16.16
  Bottom 0.61: GATE4.3 36.52,26.49 v36.5,26.3 | TOP_REV1.1 32.23,13.49 33.71,16.19 35.97,16.19
N$31
  Bottom 0.305: 36.58,29.11 37.64,30.18 37.64,34.67 C16.1 | 36.79,27.83 37.8,26.82 37.8,24.74
  Bottom 0.61: 36.58,29.11 36.58,27.83 C11.1 36.79,27.83 | 37.8,24.74 GATE4.4
N$32
  Bottom 0.305: 34.04,32.86 C11.2 34.33,29.85 34.29,26.37 35.25,25.56 GATE4.2 | 34.04,32.86 34.04,38.72 C16.2 | 34.04,32.86 31.33,32.71
  Bottom 0.61: 31.33,32.71 D7.C
PB1  (via drill 0.38)
  Top 0.152: v124.45,108.25 124.46,110.17 125.41,111.12 125.41,114.62 U7.13
  Top 0.254: 125.23,114.55 U7.13
  Bottom 0.152: v124.45,108.25 124.46,107.31 119.7,102.96 119.7,102.24 118.43,100.97 115.89,100.97 115.25,100.33 115.25,96.16 | ATGPIO.10 123.83,97.79 122.24,96.2 122.24,96.16
  Bottom 0.254: 105.26,96.84 105.94,96.16 115.25,96.16 122.24,96.16
PC1  (via drill 0.38, 0.6)
  Top 0.152: v105.71,104.11 105.41,103.82 101.92,103.82 101.92,98.74 101.28,98.11 ATGPIO.1 | v118.75,107.31 121.29,107.31 U7.24
  Top 0.254: 121.38,107.74 U7.24
  Bottom 0.152: v118.75,107.31 111.22,106.91 107.84,104.14 105.73,104.14 v105.71,104.11
PC2  (via drill 0.38)
  Top 0.152: v118.75,106.25 119.97,106.45 120.85,106.17 122.87,106.05 U7.25
  Top 0.254: 122.96,106.15 U7.25
  Bottom 0.152: v118.75,106.25 111.76,106.05 103.82,98.11 ATGPIO.2
PC3  (via drill 0.38)
  Top 0.152: v119.86,105.55 120.07,105.2 123.62,105.12 123.71,105.73 123.83,106.05 U7.26
  Top 0.254: 123.64,106.83 123.64,106.15 U7.26
  Bottom 0.152: v119.86,105.55 111.99,105.41 106.36,99.78 106.36,98.11 ATGPIO.3
PC4  (via drill 0.38)
  Top 0.152: v119.06,104.78 123.83,104.71 124.46,105.41 124.46,106.05 U7.27
  Top 0.254: 124.55,105.93 U7.27
  Bottom 0.152: v119.06,104.78 113.89,104.78 112.08,102.96 112.08,101.28 108.9,98.11 ATGPIO.4
PC5  (via drill 0.38)
  Top 0.152: v123.08,107.52 124.98,107.52 125.41,106.68 125.41,106.36 U7.28
  Bottom 0.152: v123.08,107.52 119.38,103.82 115.48,103.82 114.62,102.96 114.62,101.28 111.44,98.11 ATGPIO.5
PD4  (via drill 0.38)
  Top 0.152: v127.55,108.27 129.86,108.27 U7.2 | v123.59,103.98 122.44,103.16 122.44,101.28 119.06,98.11 ATGPIO.8
  Top 0.254: 130,108.2 U7.2
  Bottom 0.152: v123.59,103.98 v127.55,108.27
PD5  (via drill 0.6)
  Top 0.152: 112.52,98.89 112.52,95.94 114.11,94.35
  Top 0.254: v127.96,116.14 128.41,115.69 128.41,114.78 U7.9 | v109.8,108.2 109.8,101.61 112.52,98.89 | v117.29,94.35 114.11,94.35
  Bottom 0.152: ATGPIO.9 121.6,98.11 122.24,98.11 123.83,99.7 124.46,99.7 125.1,99.06 125.1,96.43 124.22,95.74 118.66,95.73 118.47,95.53
  Bottom 0.254: v127.96,116.14 124.28,116.14 122.01,114.28 115.13,114.28 112.47,111.83 112.47,109.78 110.48,108.2 v109.8,108.2 | 118.47,95.53 v117.29,94.35
REC_EXTRA1
  Top 0.254: REC.5 83.01,120.68 83.01,117.96 U$1.22/A8
REC_EXTRA2
  Top 0.254: REC.6 80.52,120.68 80.52,117.96 U$1.23/A9
REC_MOTOR
  Top 0.254: REC.4 85.74,120.68 85.74,117.96 U$1.21/A7
REC_SERVO
  Top 0.254: REC.3 88.23,120.68 88.23,117.96 U$1.20/A6
RX  (via drill 0.6)
  Top 0.254: v129.77,106.38 129.09,107.06 127.28,107.06 127.05,106.83 127.05,106.15 U7.30
  Bottom 0.254: v129.77,106.38 129.77,113.19 134.54,117.96 134.54,118.86 TXRX.1
SERVO
  Bottom 0.254: U$1.9/CS 98.22,102.52 97.31,102.52 96.18,101.39 92.77,101.39 91.87,102.29 91.87,102.97 80.74,114.1 75.07,114.1 71.66,117.5 71.66,118.18 84.83,131.35 84.83,133.17 85.28,133.62 144.53,133.62 149.3,128.85 SERVO.3
SPI_MISO  (via drill 0.6)
  Top 0.254: v122.06,115.69 122.96,114.78 U7.16
  Bottom 0.254: v122.06,115.69 115.65,115.69 111.82,112.05 111.82,110.01 110.71,109.1 108.66,109.1 103.44,103.88 103.44,102.75 U$1.11/MOSI
SPI_MOSI  (via drill 0.6)
  Top 0.254: v107.3,114.32 107.3,118.4 | 107.3,118.4 107.3,118.41 | v106.62,110.69 106.62,103.43 105.94,102.75 U$1.12/MISO | U7.15 123.64,114.78 123.64,115.46 122.51,116.59 120.69,116.59 119.79,117.5 119.79,122.5 119.11,123.18 112.07,123.18 109.96,123.15 107.46,121.4 107.3,118.4
  Bottom 0.254: v107.3,114.32 107.3,111.37 v106.62,110.69
SPI_SCK
  Top 0.25: U$1.13/SCK 105.89,114.47 106.96,113.4 121.28,113.4 U7.17
SPI_SS  (via drill 0.6)
  Top 0.254: v123.87,113.19 124.55,113.87 124.55,114.55 U7.14
  Bottom 0.254: v123.87,113.19 120.69,113.19 120.47,113.42 115.15,113.42 113.13,111.6 113.13,109.56 107.98,105.02 105.26,105.02 104.58,104.34 104.58,102.29 103.67,101.39 102.08,101.39 100.94,102.52 U$1.10/CS
SW1  (via drill 0.6)
  Top 0.254: v142.03,114.55 142.71,115.23 144.07,115.23 S1.1 | v139.08,113.42 139.08,115.01 137.04,117.05 133.63,117.05 v132.95,117.73 | v110.71,110.47 110.71,102.97 110.93,102.75 U$1.24
  Bottom 0.254: v142.03,114.55 140.22,114.55 v139.08,113.42 | v132.95,117.73 131.59,119.09 118.2,119.09 117.29,118.18 115.02,116.14 110.71,111.83 v110.71,110.47
SW2  (via drill 0.6)
  Top 0.152: v114.56,95.26 112.99,96.12 112.98,102.07
  Top 0.25: 126.14,92.76 125.99,92.76 v125.34,91.65
  Top 0.254: 126.14,92.76 135.44,92.76 138.16,90.04 152.02,90.04 154.74,92.76 154.74,102.29 155.43,102.97 155.88,102.97 156.11,103.2 156.11,104.56 154.52,106.15 152.47,106.15 146.12,112.51 144.3,112.51 S1.2 | 112.98,102.07 113.43,102.52 U$1.25
  Bottom 0.254: v114.56,95.26 118.17,91.65 v125.34,91.65
SW3  (via drill 0.6)
  Top 0.254: v145.89,109.33 145.21,110.01 144.3,110.01 S1.3 | v145.89,104.34 145.21,103.66 v142.71,103.66 | v116.15,100.02 116.15,102.52 U$1.26
  Bottom 0.254: v145.89,104.34 v145.89,109.33 | v142.71,103.66 142.71,103.2 139.76,100.25 116.38,100.25 v116.15,100.02
SW4  (via drill 0.6)
  Top 0.152: 117.52,95.71 117.52,100.48 118.42,101.39 118.42,102.52
  Top 0.254: v142.94,106.38 144.07,107.51 S1.4 | v121.15,94.8 120.47,94.8 119.55,93.94 118.64,93.94 118.2,94.35 118.2,95.03 117.52,95.71 | 118.42,102.52 U$1.27
  Bottom 0.254: v142.94,106.38 142.94,104.79 143.62,104.11 143.62,102.39 138.95,97.73 138.34,97.15 135.85,94.65 v121.15,94.8
THERM1  (via drill 0.38 pad 0.01)  (15 unrouted)
  other vias: 190.55,129.15 191.19,129.15 190.55,128.51 191.19,128.51 190.55,127.88 191.19,127.88 190.55,127.24 191.19,127.24 190.55,126.61 191.19,126.61 190.55,125.97 191.19,125.97 190.55,125.34 191.19,125.34 190.55,124.7 191.19,124.7
  pour Bottom: 182.71,133.9 198.71,133.9 198.71,119.9 182.71,119.9
  pour Top: 182.71,133.9 182.71,119.9 198.71,119.9 198.71,133.9
THERM2  (via drill 0.38 pad 0.05)  (15 unrouted)
  other vias: 190.26,96.33 190.89,96.33 190.26,95.69 190.89,95.69 190.26,95.06 190.89,95.06 190.26,94.42 190.89,94.42 190.26,96.96 190.89,96.96 190.26,97.59 190.89,97.59 190.26,98.23 190.89,98.23 190.26,98.87 190.91,98.87
  pour Top: 182.71,103.9 182.71,89.4 198.71,89.4 198.71,103.9
  pour Bottom: 182.71,103.9 198.71,103.9 198.71,89.4 182.71,89.4
TX
  Top 0.254: U7.31 127.96,105.93 127.96,105.24 129.32,103.88 134.77,103.88 136.81,102.6 136.81,100.79 137.41,100.18 138.63,100.18 140.01,101.55 140.01,102.28 139.99,102.29 139.99,114.78 137.26,117.5 137.26,118.86 TXRX.2

## Text on the board
tPlace: POWER | POWER | LM1086 | RX | TX | GND | 3.3 | D1 | SIG | 5V | GND | R9 | 7.4V | GND | 7.4V | GND | 7.4 | NC | NC | BLT | D2 | GND | SVO | R10 | D3 | R11 | C8 | A9 | A8 | MOTOR | SERVO | 5V | GND | C4 | HL1 | HL1B | A22 | A21 | A14 | 3.3 | GND | OUT | 3.3 | GND | OUT | REC | A20 | A19 | A18 | A17 | A16 | A15 | RX | TX | TGPIO | C3 | HL2 | HL2B | R6 | GND | T1 | C5 | GND | R3 | R4 | R2 | R1 | ATMEGA / 328P | C7 | GND | GND | 7.4 | FUSE | Y1 | GND | T2 | R8 | 5V | C6 | R7 | PD4 | PB1 | GND | 3.3 | A0 | CLK | SI | GND | C1 | ADC6 | CAM.B | CAM | ATGPIO | ACD7 | PD5 | SI | CLK | A0 | 3.3 | GND | C2 | PC1 | PC2 | PC3 | PC4 | PC5 | 5V | 5V | NC | PWR | 3.3V | 3.3V | GND | POWER | 7.4V | GND | C4 | C3 | C7 | FUSE | C1 | C2